# EAGLE design esp-livingcolors (EAGLE 9.6.2)
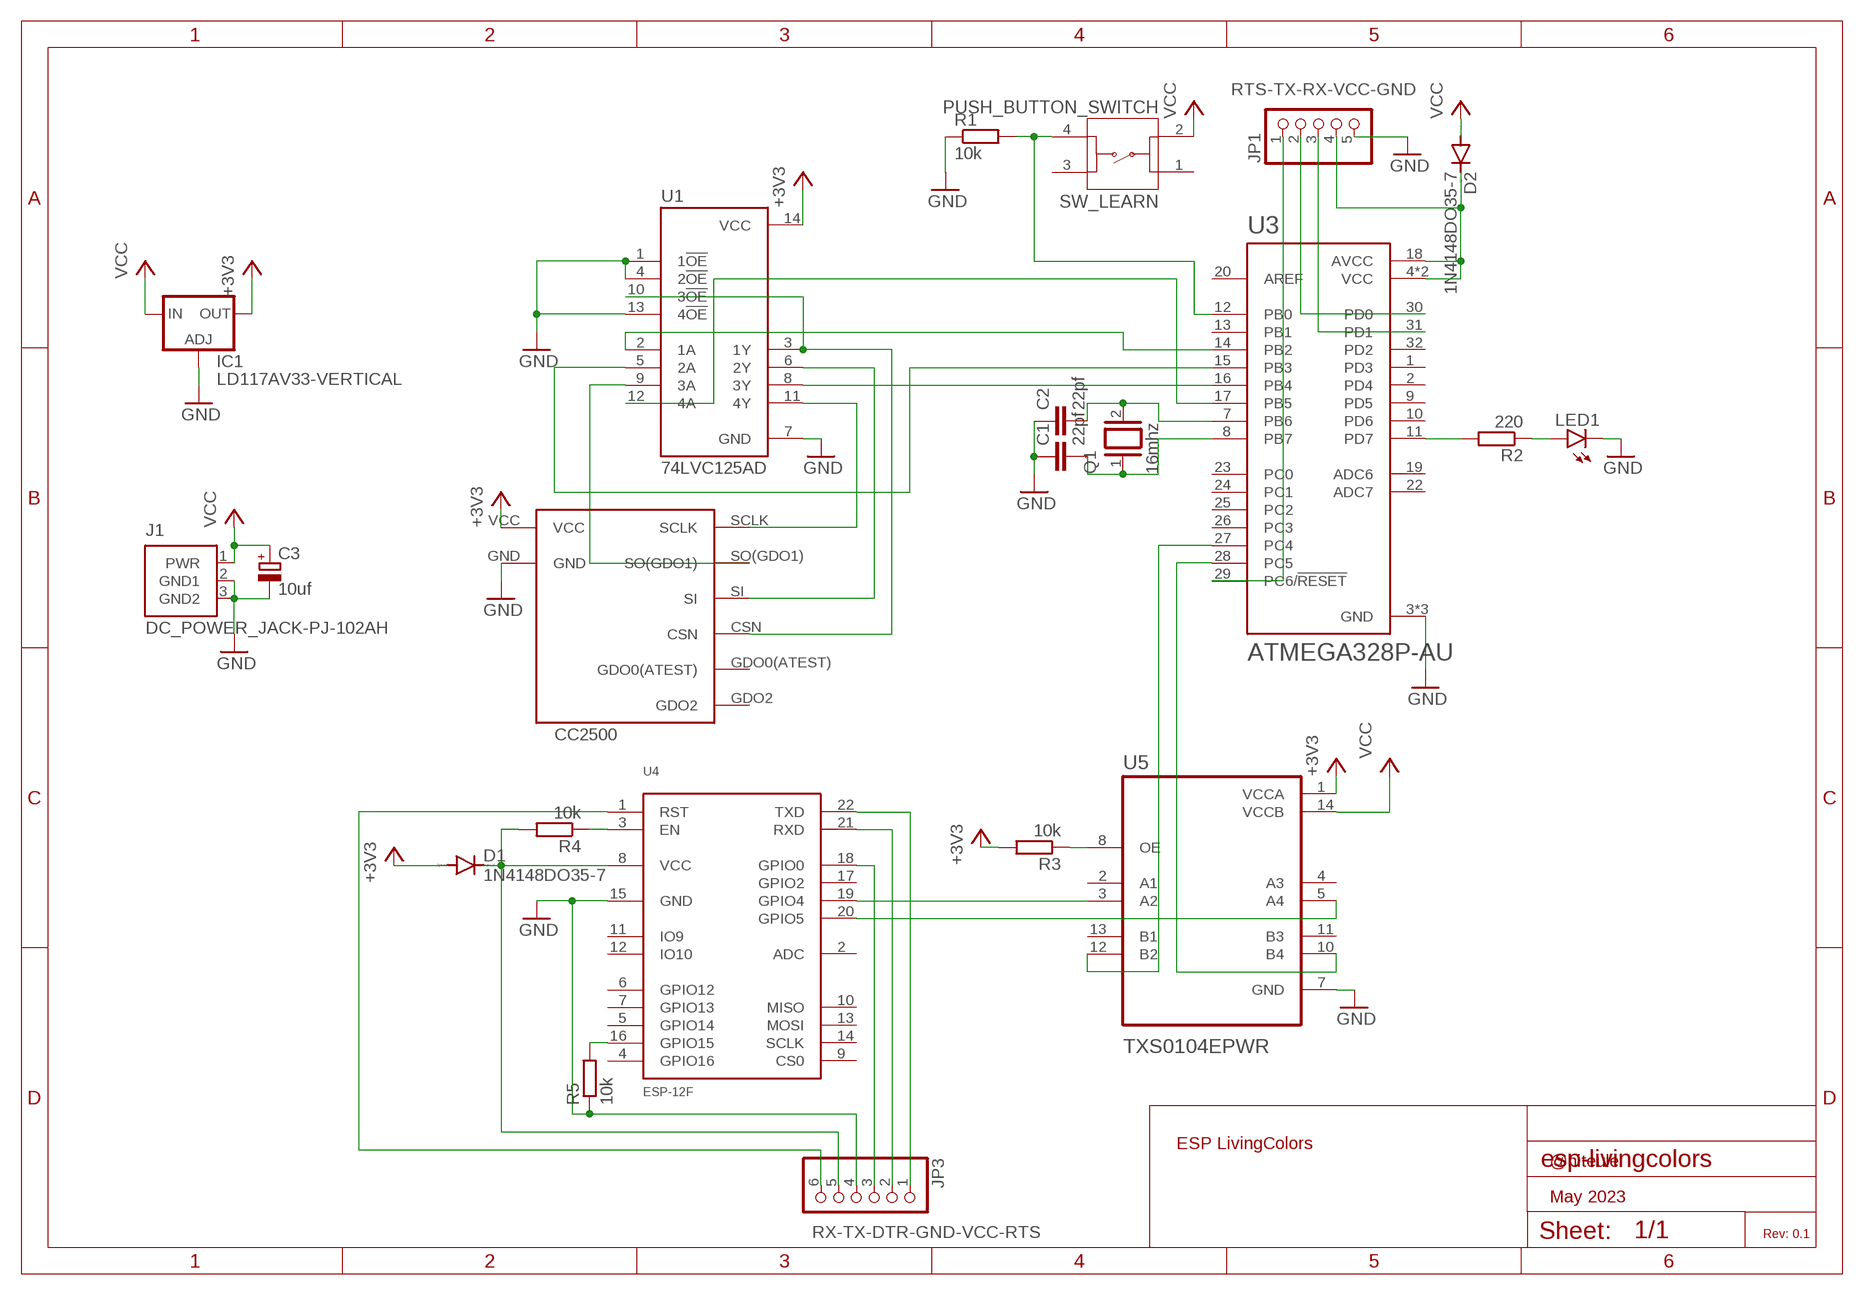
[diagram p0: schematic, sheet 1]

## Parts
C1  22pf  C-EU025-024X044  [C025-024X044]
C2  22pf  C-EU025-024X044  [C025-024X044]
C3  10uf  CPOL-EUE2,5-6E  [E2,5-6E]
D1  1N4148DO35-7  [DO35-7]
D2  1N4148DO35-7  [DO35-7]
IC1  LD117AV33-VERTICAL  [TO220S-VERTICAL]
J1  DC_POWER_JACK-PJ-102AH  [PJ-102AH]
JP1  RTS-TX-RX-VCC-GND  PINHD-1X5  [1X05]
JP3  RX-TX-DTR-GND-VCC-RTS  PINHD-1X6  [1X06]
LED1  LED3MM  [LED3MM]
Q1  16mhz  XTAL/S  [QS]
R1  10k  R-EU_0204/7  [0204/7]
R2  220  R-EU_0204/7  [0204/7]
R3  10k  R-EU_0204/7  [0204/7]
R4  10k  R-EU_0204/7  [0204/7]
R5  10k  R-EU_0207/12  [0207/12]
SW_LEARN  PUSH_BUTTON_SWITCH  [PUSH_BUTTON_SWITCH]
U1  74LVC125AD  [SOIC127P600X175-14N]
U3  ATMEGA328P-AU  [QFP80P900X900X120-32N]
U4  ESP-12F  [ESP-12F]
U5  TXS0104EPWR  [SOP65P640X120-14N]
U$1  CC2500-ANTENNA-MODULE  [CC2500-ANTENNA-MODULE]

## Nets
+3V3: D1.A IC1.2(OUT) R3.2 U1.14(VCC) U5.1(VCCA) U$1.VCC
GND: C1.1 C2.1 C3.- IC1.1(ADJ) J1.2(GND1) J1.3(GND2) JP1.5 JP3.4 LED1.K(C) R1.1 R5.1 U1.1(1!OE!) U1.4(2!OE!) U1.7(GND) U1.13(4!OE!) U3.3(GND) U3.5(GND) U3.21(GND) U4.15(GND) U5.7(GND) U$1.GND
N$1: R1.2 SW_LEARN.4 U3.12(PB0)
N$2: C2.2 Q1.2 U3.7(PB6)
N$3: C1.2 Q1.1 U3.8(PB7)
N$4: R2.2 U3.11(PD7)
N$5: LED1.A R2.1
N$6: U1.9(3A) U$1.SO(GDO1)
N$7: R4.1 U4.3(EN)
N$8: U1.3(1Y) U1.10(3!OE!) U$1.CSN
N$9: U1.2(1A) U3.14(PB2)
N$10: U1.5(2A) U3.15(PB3)
N$11: U1.6(2Y) U$1.SI
N$12: U1.8(3Y) U3.16(PB4)
N$13: JP3.6 U4.1(RST)
N$14: U1.11(4Y) U$1.SCLK
N$15: U1.12(4A) U3.17(PB5)
N$16: U3.27(PC4) U5.12(B2)
N$17: R3.1 U5.8(OE)
N$18: U3.28(PC5) U5.10(B4)
N$19: U4.19(GPIO4) U5.3(A2)
N$20: U4.20(GPIO5) U5.5(A4)
N$21: JP3.1 U4.22(TXD)
N$22: JP3.3 U4.18(GPIO0)
N$23: JP3.2 U4.21(RXD)
N$24: D1.C JP3.5 R4.2 U4.8(VCC)
N$25: R5.2 U4.16(GPIO15)
N$29: D2.C JP1.4 U3.4(VCC) U3.6(VCC) U3.18(AVCC)
N$30: JP1.1 U3.29(PC6/!RESET)
N$31: JP1.2 U3.30(PD0)
N$32: JP1.3 U3.31(PD1)
VCC: C3.+ D2.A IC1.3(IN) J1.1(PWR) SW_LEARN.2 U5.14(VCCB)
Unconnected: SW_LEARN.1 SW_LEARN.3 U3.1(PD3) U3.2(PD4) U3.9(PD5) U3.10(PD6) U3.13(PB1) U3.19(ADC6) U3.20(AREF) U3.22(ADC7) U3.23(PC0) U3.24(PC1) U3.25(PC2) U3.26(PC3) U3.32(PD2) U4.2(ADC) U4.4(GPIO16) U4.5(GPIO14) U4.6(GPIO12) U4.7(GPIO13) U4.9(CS0) U4.10(MISO) U4.11(IO9) U4.12(IO10) U4.13(MOSI) U4.14(SCLK) U4.17(GPIO2) U5.2(A1) U5.4(A3) U5.11(B3) U5.13(B1) U$1.GDO0(ATEST) U$1.GDO2

## Notes on the sheet
- ESP LivingColors
- @hiteule
- May 2023
- Rev: 0.1

## Library data of the parts
C1 C2 = rcl:C-EU: CAPACITOR, European symbol; SPICEPREFIX: C
C3 = rcl:CPOL-EU: POLARIZED CAPACITOR, European symbol; SPICEPREFIX: C
D1 D2 = diode:1N4148: DIODE high speed (Philips)
IC1 = regulator:LD117AV33-VERTICAL
J1 = CONNECTORS:DC_POWER_JACK: DC Power Jack
JP1 = pinhead:PINHD-1X5: PIN HEADER
JP3 = pinhead:PINHD-1X6: PIN HEADER
LED1 = led:LED: LED OSRAM: - CHIPLED LG R971, LG N971, LY N971, LG Q971, LY Q971, LO R971, LY R971 LH N974, LH R974 LS Q976, LO Q976, LY Q976 LO Q996 - Hyper CHIPLED LW Q18S LB Q993, LB Q99A, LB R99A - SideLED LS A670, LO A670, LY A670, LG A670, LP A670 LB A673, LV A673, LT A673, LW A673 LH A674 LY A675 LS A676, LA A676, LO A676, LY A676, LW A676 LS A679, LY A679, LG A679 - Hyper Micro SIDELED® LS Y876, LA Y876, LO Y876, LY Y876 LT Y87S - SmartLED LW L88C, LW L88S LB L89C, LB L89S, LG L890 LS L89K, LO L89K, LY L89K LS L896, LA L896, LO L896, LY L896 - TOPLED LS T670, LO T670, LY T670, LG T670, LP T670 LSG T670, LSP T670, LSY T670, LOP T670, LYG T670 LG T671, LOG T671, LSG T671 LB T673, LV T673, LT T673, LW T673 LH T674 LS T676, LA T676, LO T676, LY T676, LB T676, LH T676, LSB T676, LW T676 LB T67C, LV T67C, LT T67C, LS T67K, LO T67K, LY T67K, LW E67C LS E67B, LA E67B, LO E67B, LY E67B, LB E67C, LV E67C, LT E67C LW T67C LS T679, LY T679, LG T679 LS T770, LO T770, LY T770, LG T770, LP T770 LB T773, LV T773, LT T773, LW T773 LH T774 LS E675, LA E675, LY E675, LS T675 LS T776, LA T776, LO T776, LY T776, LB T776 LHGB T686 LT T68C, LB T68C - Hyper Mini TOPLED® LB M676 - Mini TOPLED Santana® LG M470 LS M47K, LO M47K, LY M47K Source: http://www.osram.convergy.de LUXEON: - LUMILED® LXK2-PW12-R00, LXK2-PW12-S00, LXK2-PW14-U00, LXK2-PW14-V00 LXK2-PM12-R00, LXK2-PM12-S00, LXK2-PM14-U00 LXK2-PE12-Q00, LXK2-PE12-R00, LXK2-PE12-S00, LXK2-PE14-T00, LXK2-PE14-U00 LXK2-PB12-K00, LXK2-PB12-L00, LXK2-PB12-M00, LXK2-PB14-N00, LXK2-PB14-P00, LXK2-PB14-Q00 LXK2-PR12-L00, LXK2-PR12-M00, LXK2-PR14-Q00, LXK2-PR14-R00 LXK2-PD12-Q00, LXK2-PD12-R00, LXK2-PD12-S00 LXK2-PH12-R00, LXK2-PH12-S00 LXK2-PL12-P00, LXK2-PL12-Q00, LXK2-PL12-R00 Source: www.luxeon.com KINGBRIGHT: KA-3528ASYC Source: www.kingbright.com
Q1 = special:XTAL/S: CRYSTAL
R1-R5 = rcl:R-EU_: RESISTOR, European symbol; SPICEPREFIX: R
SW_LEARN = CONNECTORS:PUSH_BUTTON_SWITCH: Push button switch
U1 = 74LVC125AD:74LVC125AD: Check availability <https://pricing.snapeda.com/parts/74LVC125AD/NXP%20Semiconductors/view-part?ref=eda>; AVAILABILITY: In Stock; DESCRIPTION: Buffer/Line Driver 4-CH Non-Inverting 3-ST CMOS 14-Pin SO; MF: NXP Semiconductors; MP: 74LVC125AD; PACKAGE: SOIC-14 NXP Semiconductors; PRICE: None; PURCHASE-URL: https://pricing.snapeda.com/search/part/74LVC125AD/?ref=eda
U3 = ATMEGA328P-AU:ATMEGA328P-AU: ATmega Series 20 MHz 32 KB Flash 2 KB SRAM 8-Bit Microcontroller - TQFP-32 Check availability <https://pricing.snapeda.com/parts/ATMEGA328P-AU/Microchip%20Technology/view-part?ref=eda>; AVAILABILITY: In Stock; DESCRIPTION: AVR AVR® ATmega Microcontroller IC 8-Bit 20MHz 32KB (16K x 16) FLASH 32-TQFP (7x7); MF: Microchip Technology; MP: ATMEGA328P-AU; PACKAGE: TQFP-32 Microchip; PRICE: None; PURCHASE-URL: https://pricing.snapeda.com/search/part/ATMEGA328P-AU/?ref=eda
U4 = ESP-12F:ESP-12F: 317060163 Check availability <https://pricing.snapeda.com/parts/ESP-12F/AI-Thinker/view-part?ref=eda>; AVAILABILITY: Not in stock; DESCRIPTION: WiFi Module; MF: AI-Thinker; MP: ESP-12F; PACKAGE: Package; PRICE: None
U5 = TXS0104EPWR:TXS0104EPWR: Check availability <https://pricing.snapeda.com/parts/TXS0104EPWR/Texas%20Instruments/view-part?ref=eda>; AVAILABILITY: In Stock; DESCRIPTION: 4-Bit Bidirectional Voltage-Level Shifter for Open-Drain and Push-Pull Applications; MF: Texas Instruments; MP: TXS0104EPWR; PACKAGE: TSSOP-14 Texas Instruments; PRICE: None; PURCHASE-URL: https://pricing.snapeda.com/search/part/TXS0104EPWR/?ref=eda
U$1 = CC2500:CC2500-ANTENNA-MODULE

## Board
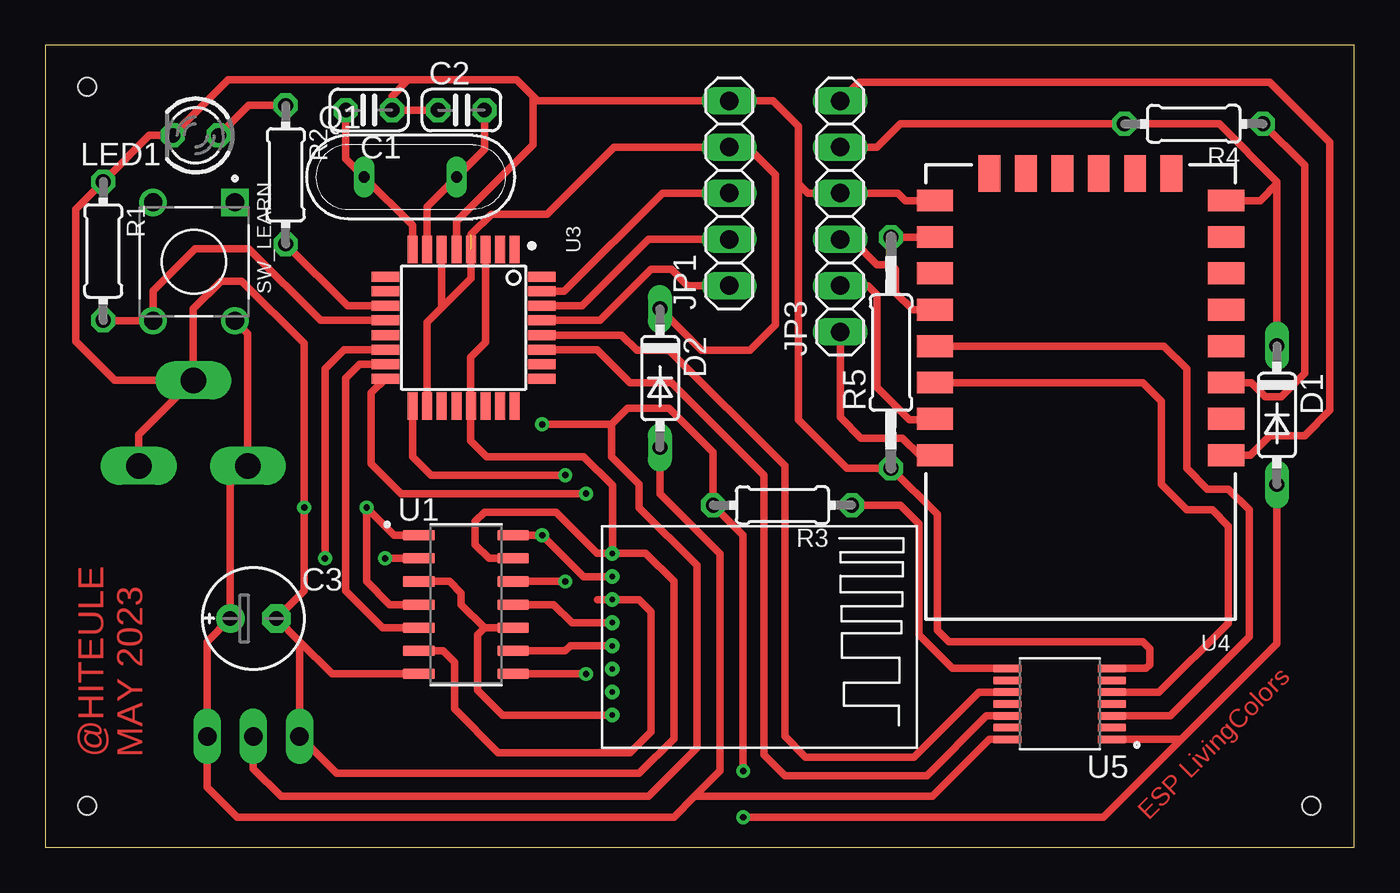
[diagram p1: board, top side]
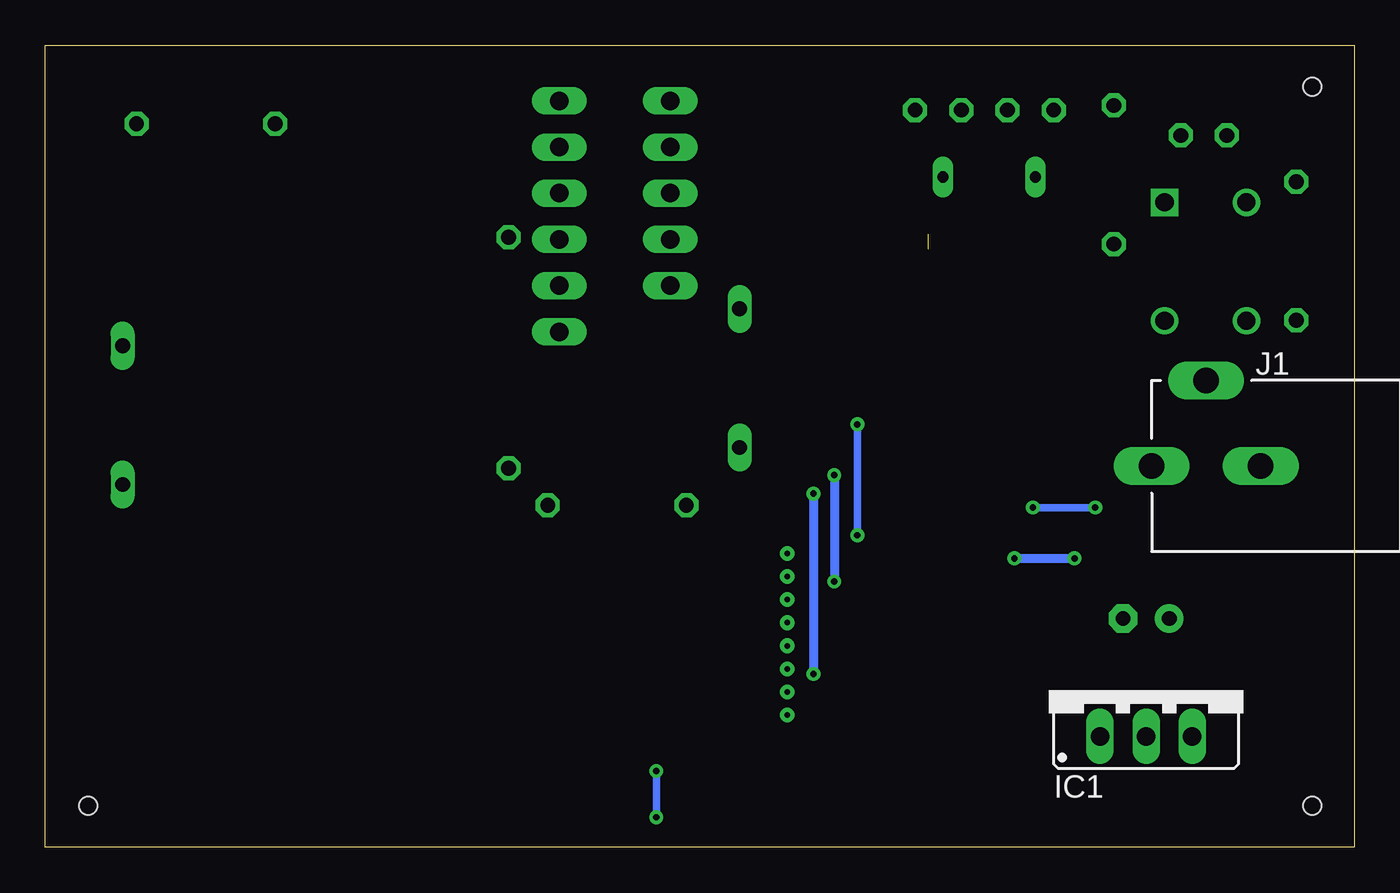
[diagram p2: board, bottom side, seen from below]

Size 71.93 x 44.06 mm. Coordinates in mm from the lower left corner, seen from the top.
Outline: 0,0 71.93,0 71.93,44.06 0,44.06 0,0
Copper layers (1*16): Top 0.035mm / dielectric 1.5mm / Bottom 0.035mm
Design rules "default": minimum track width 6mil, minimum drill 0.35mm, track to track 6mil, track to pad 6mil, pad to pad 6mil, via to via 6mil, smd to smd 6mil, copper to edge 40mil, drill to drill 6mil, minimum pad ring 10mil, minimum via ring 8mil, stop-mask expansion 4mil, vias tented up to drill 0mil, thermal gap 10mil
Holes 1 mm at 2.29,41.78 69.6,2.29 2.29,2.29

### Footprints (pad centres in the part's own frame; a part is rotated, then mirrored left to right if it is on the bottom)
C025-024X044 = drill 0.813 octagon: 1 -1.27,0; 2 1.27,0
E2,5-6E = drill 0.813 pad 1.575: + -1.27,0 | drill 0.813 pad 1.575 octagon: - 1.27,0
DO35-7 = drill 0.813 long: A 3.81,0; C -3.81,0
TO220S-VERTICAL = drill 1.016 long: 1 -2.54,-2.54; 2 0,-2.54; 3 2.54,-2.54
PJ-102AH = drill 1.4 long: 1 0,-3; 2 0,3; 3 -4.7,0
1X05 = drill 1.016 long: 1 -5.08,0; 2 -2.54,0; 3 0,0; 4 2.54,0; 5 5.08,0
1X06 = drill 1.016 long: 1 -6.35,0; 2 -3.81,0; 3 -1.27,0; 4 1.27,0; 5 3.81,0; 6 6.35,0
LED3MM = drill 0.813 octagon: A -1.27,0; K 1.27,0
QS = drill 0.61 long: 1 -2.54,0; 2 2.54,0
0204/7 = drill 0.813 octagon: 1 -3.81,0; 2 3.81,0
0207/12 = drill 0.813 octagon: 1 -6.35,0; 2 6.35,0
PUSH_BUTTON_SWITCH = drill 0.99 square: 1 0,0 | drill 0.99: 2 6.5,0; 3 0,-4.5; 4 6.5,-4.5
SOIC127P600X175-14N = smd 1.75 x 0.59: 1 -2.585,3.81; 2 -2.585,2.54; 3 -2.585,1.27; 4 -2.585,0; 5 -2.585,-1.27; 6 -2.585,-2.54; 7 -2.585,-3.81; 8 2.585,-3.81; 9 2.585,-2.54; 10 2.585,-1.27; 11 2.585,0; 12 2.585,1.27; 13 2.585,2.54; 14 2.585,3.81
QFP80P900X900X120-32N = smd 1.5 x 0.55: 1 -4.3,2.8; 2 -4.3,2; 3 -4.3,1.2; 4 -4.3,0.4; 5 -4.3,-0.4; 6 -4.3,-1.2; 7 -4.3,-2; 8 -4.3,-2.8; 17 4.3,-2.8; 18 4.3,-2; 19 4.3,-1.2; 20 4.3,-0.4; 21 4.3,0.4; 22 4.3,1.2; 23 4.3,2; 24 4.3,2.8 | smd 0.55 x 1.5: 9 -2.8,-4.3; 10 -2,-4.3; 11 -1.2,-4.3; 12 -0.4,-4.3; 13 0.4,-4.3; 14 1.2,-4.3; 15 2,-4.3; 16 2.8,-4.3; 25 2.8,4.3; 26 2,4.3; 27 1.2,4.3; 28 0.4,4.3; 29 -0.4,4.3; 30 -1.2,4.3; 31 -2,4.3; 32 -2.8,4.3
ESP-12F = smd 2 x 1.2: 1 -8,3.48; 2 -8,1.48; 3 -8,-0.52; 4 -8,-2.52; 5 -8,-4.52; 6 -8,-6.52; 7 -8,-8.52; 8 -8,-10.52; 15 8,-10.52; 16 8,-8.52; 17 8,-6.52; 18 8,-4.52; 19 8,-2.52; 20 8,-0.52; 21 8,1.48; 22 8,3.48 | smd 1.2 x 2: 9 -5,-12; 10 -3,-12; 11 -1,-12; 12 1,-12; 13 3,-12; 14 5,-12
SOP65P640X120-14N = smd 1.57 x 0.41: 1 -2.87,1.95; 2 -2.87,1.3; 3 -2.87,0.65; 4 -2.87,0; 5 -2.87,-0.65; 6 -2.87,-1.3; 7 -2.87,-1.95; 8 2.87,-1.95; 9 2.87,-1.3; 10 2.87,-0.65; 11 2.87,0; 12 2.87,0.65; 13 2.87,1.3; 14 2.87,1.95
CC2500-ANTENNA-MODULE = drill 0.3: CSN 0.559,1.8; GDO0(ATEST) 0.559,3.07; GDO2 0.559,4.34; GND 0.559,10.69; SCLK 0.559,6.88; SI 0.559,8.15; SO(GDO1) 0.559,5.61; VCC 0.559,9.42

### Placement (x,y rotation side)
C1  17.78,40.51 180 top
C2  22.86,40.51 0 top
C3  11.43,12.57 0 top
D1  67.69,23.75 270 top
D2  33.78,25.78 270 top
IC1  11.43,8.64 0 bottom
J1  8.13,20.95 270 bottom
JP1  37.59,35.94 90 top
JP3  43.69,34.67 90 top
LED1  8.26,39.12 180 top
Q1  20.07,36.83 0 top
R1  3.17,32.77 270 top
R2  13.21,36.96 270 top
R3  40.51,18.8 180 top
R4  63.12,39.75 180 top
R5  46.48,27.18 90 top
SW_LEARN  10.41,35.43 270 top
U1  23.11,13.34 0 top
U3  22.99,28.55 270 top
U4  56.9,25.02 180 top
U5  55.75,7.87 180 top
U$1  30.61,5.46 0 top

### Tracks (layer width: path | path; a pad name or v marks a point on that pad's centre or on a via)
+3V3  (via drill 0.35)
  Top 0.406: D1.A 67.69,11.18 62.42,5.91 | U1.14 v27.3,17.14 29.59,14.86 31.14,14.86 U$1.VCC | v27.3,23.24 31.11,23.24 | 31.11,23.24 32,24.13 34.29,24.13 36.7,21.72 R3.2 38.35,17.14 v38.35,4.19 | 62.42,5.91 58.17,1.65 v38.35,1.65 | IC1.2 11.43,4.32 12.95,2.79 33.15,2.79 35.81,5.46 35.81,15.49 32.64,18.67 32.64,19.94 31.11,21.46 31.11,23.24 | U5.1 62.4,5.92 62.42,5.91
  Bottom 0.406: v27.3,23.24 v27.3,17.14 | v38.35,4.19 v38.35,1.65
GND  (via drill 0.35)
  Top 0.406: U3.5 22.59,34.4 26.8,38.61 26.8,41.27 | v14.22,18.67 | J1.2 5.13,22.66 J1.3 | v14.22,18.67 14.22,14.1 C3.- 13.97,11.3 | J1.3 3.81,25.65 1.65,27.81 1.65,35.05 R1.1 5.71,39.12 LED1.K 10.03,42.16 19.94,42.16 | v14.22,18.67 14.22,27.69 10.79,31.11 9.65,31.11 8.13,29.59 J1.3 | C2.1 C1.1 | C1.1 19.43,40.51 | 26.8,41.27 25.91,42.16 19.94,42.16 | U1.13 24.38,15.88 23.62,16.64 23.62,17.91 24.13,18.41 28.07,18.41 30.33,16.15 U$1.GND | U3.3 24.19,27.74 23.37,26.92 23.37,24.27 U3.21 23.37,24.23 23.37,22.35 24.26,21.46 29.59,21.46 31.17,19.89 U$1.GND | U1.1 19.18,17.14 v17.65,18.67 17.65,14.61 18.92,13.34 U1.4 | C1.1 19.05,41.27 19.94,42.16 | 13.97,11.3 IC1.1 16,4.06 32.64,4.06 34.54,5.97 34.54,14.61 33,16.15 U$1.GND | U1.7 15.75,9.53 13.97,11.3 | 41.4,36.45 41.4,39.62 40.01,41.02 JP1.5 27.05,41.02 26.8,41.27 | 48.88,35.56 U4.15 47.27,35.54 46.86,35.94 JP3.4 41.91,35.94 41.4,36.45 | 41.4,36.45 41.4,23.5 44.07,20.83 R5.1 49.02,18.29 49.02,11.94 49.66,11.3 60.33,11.3 60.71,10.92 60.71,10.03 60.5,9.82 U5.7
  Top 0.508: 20.95,17.14 U1.1
  Bottom 0.406: v17.65,18.67 v14.22,18.67
N$1
  Top 0.406: U3.12 15.12,28.95 11.18,32.89 8.22,32.89 5.91,30.58 SW_LEARN.4 3.2,28.93 R1.2
N$2
  Top 0.406: U3.7 20.99,35.21 Q1.2 24.13,38.35 C2.2
N$3
  Top 0.406: U3.8 20.19,34.17 Q1.1 16.51,37.85 C1.2
N$4
  Top 0.406: U3.11 16.61,29.75 R2.2
N$5
  Top 0.406: LED1.A 11.18,40.77 R2.1
N$6
  Top 0.406: U1.9 28.57,10.79 28.85,11.07 U$1.SO(GDO1)
N$7
  Top 0.406: R4.1 69.22,37.47 69.22,26.04 67.94,24.77 67.06,24.77 66.28,25.54 U4.3
N$8
  Top 0.406: U1.10 24.13,12.06 | 24.13,12.06 22.86,13.34 22.86,13.97 22.23,14.61 U1.3 | 24.13,12.06 23.75,11.68 23.75,8.64 25.12,7.26 U$1.CSN
N$9  (via drill 0.35)
  Top 0.406: U3.14 16.43,27.35 15.37,26.29 v15.37,15.88 | U1.2 v18.67,15.88
  Bottom 0.508: v18.67,15.88 v15.37,15.88
N$10
  Top 0.406: U3.15 17.28,26.55 16.51,25.78 16.51,14.1 18.54,12.06 U1.5
  Top 0.508: U3.15 18.68,26.56
N$11
  Top 0.406: U1.6 21.84,10.79 22.48,10.16 22.48,7.62 24.89,5.21 32.13,5.21 33.27,6.35 33.27,12.95 32.62,13.61 U$1.SI 31.14,13.59 30.35,13.59
N$12  (via drill 0.35)
  Top 0.406: v29.72,19.43 19.56,19.43 17.91,21.08 17.91,24.97 U3.16 | U1.8 v29.72,9.53
  Bottom 0.508: v29.72,19.43 v29.72,9.53
N$13
  Top 0.406: U4.1 66.24,21.54 67.31,22.61 69.22,22.61 70.61,24 70.61,38.73 67.31,42.04 44.7,42.04 JP3.6
N$14
  Top 0.406: U1.11 27.94,13.34 28.93,12.34 U$1.SCLK
N$15  (via drill 0.35)
  Top 0.406: U3.17 20.19,21.47 21.21,20.45 v28.57,20.45 | U1.12 v28.57,14.61
  Bottom 0.508: v28.57,20.45 v28.57,14.61
N$16
  Top 0.406: U3.27 30.31,27.35 32.13,25.53 34.42,25.53 39.5,20.45 39.5,5.08 40.64,3.94 48.45,3.94 51.73,7.22 U5.12
N$17
  Top 0.406: U5.8 49.87,9.82 48.01,11.68 48.01,17.78 46.99,18.8 R3.1
N$18
  Top 0.406: U3.28 31.67,28.15 32.51,27.3 34.29,27.3 40.64,20.95 40.64,6.1 41.78,4.95 47.75,4.95 51.32,8.52 U5.10
N$19
  Top 0.406: U4.19 61.49,27.54 62.74,26.29 62.74,20.83 63.88,19.68 65.02,19.68 66.17,18.54 66.17,11.56 61.83,7.22 U5.3
N$20
  Top 0.406: U4.20 60.31,25.54 61.34,24.51 61.34,19.94 62.74,18.54 64.14,18.54 65.02,17.65 65.02,12.32 61.21,8.51 59.65,8.51 59.64,8.52 U5.5
N$21
  Top 0.406: U4.22 48.06,21.54 47.12,22.48 44.83,22.48 43.69,23.62 JP3.1
N$22
  Top 0.406: JP3.3 44.32,33.4 45.72,32 46.48,32 46.74,31.75 46.74,30.48 47.68,29.54 U4.18
N$23
  Top 0.406: JP3.2 45.21,30.86 45.72,30.35 45.72,25.27 47.5,23.5 48.85,23.5 U4.21
N$24
  Top 0.406: 65.04,35.39 U4.8 66.78,35.54 67.69,36.45 | 67.69,36.45 67.69,36.58 64.52,39.75 R4.2 46.99,39.75 45.72,38.48 JP3.5 | 67.69,36.45 D1.C
N$25
  Top 0.406: R5.2 48.88,33.53 U4.16
N$29  (1 unrouted)
  Top 0.406: 23.39,33.67 24.51,34.8 27.56,34.8 31.24,38.48 JP1.4 38.61,38.48 40.13,36.96 40.13,28.7 38.73,27.3 36.07,27.3 D2.C | U3.6 21.79,29.66 | U3.18 20.99,28.86 21.79,29.66 | U3.4 23.39,31.26 21.79,29.66
N$30
  Top 0.406: U3.29 30.47,28.95 33.27,31.75 34.42,31.75 35.31,30.86 JP1.1
N$31
  Top 0.406: U3.30 29.5,29.75 33.15,33.4 JP1.2
N$32
  Top 0.406: U3.31 28.52,30.55 33.91,35.94 JP1.3
VCC
  Top 0.406: SW_LEARN.2 11.13,28.22 J1.1 10.16,19.99 C3.+ 8.89,11.3 IC1.3 8.89,3.3 10.54,1.65 34.54,1.65 35.69,2.79 | 35.69,2.79 37.08,4.19 37.08,16.13 33.78,19.43 D2.A | 35.69,2.79 48.77,2.79 51.9,5.92 U5.14

### Text on the board
Top: @HITEULE / MAY 2023 | ESP LivingColors